# EAGLE schematic Block_Diagram_V1 (EAGLE 8.2.2)
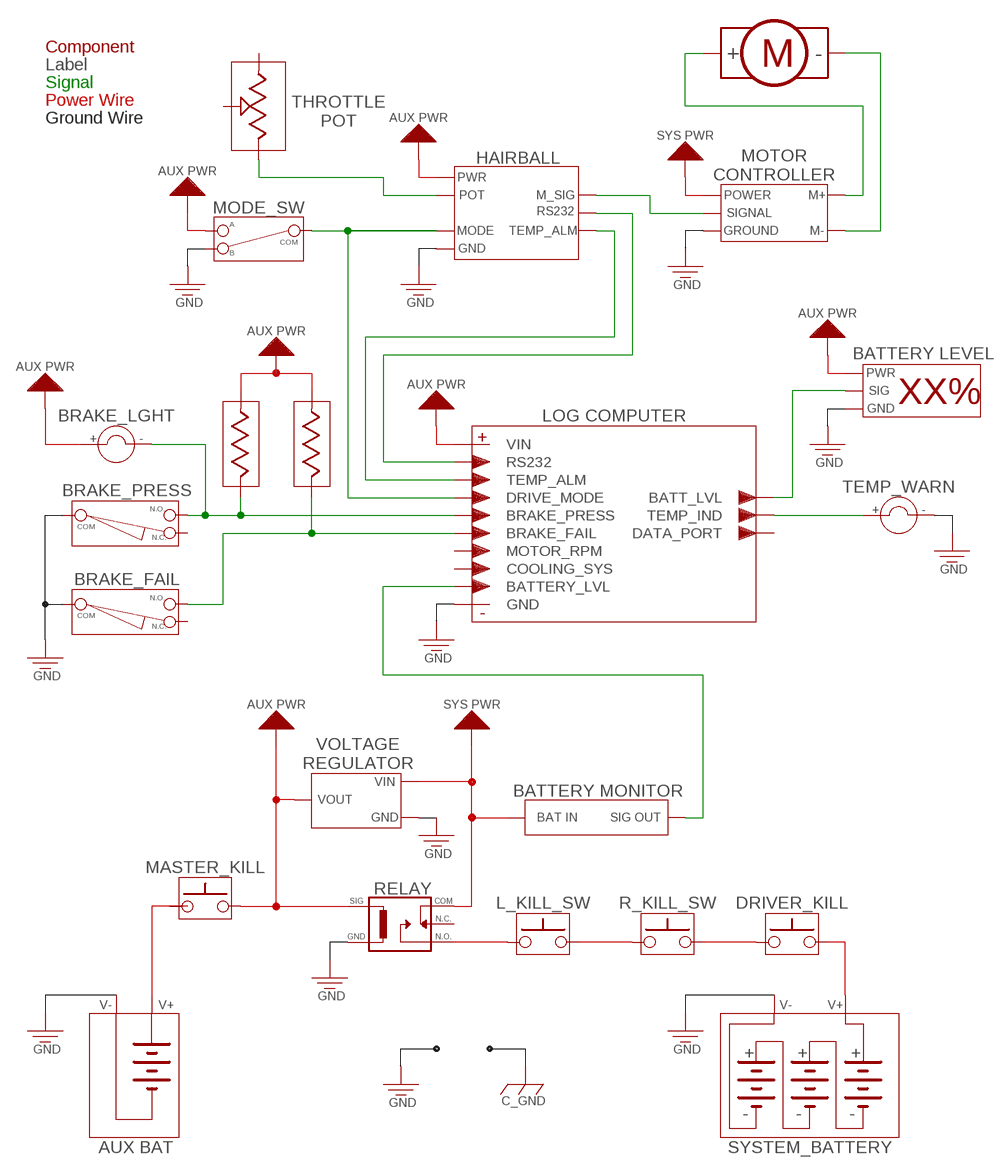
[diagram p0: schematic, sheet 1]

## Parts
BRAKE_FAIL  LIMIT_SWITCH  [LIMIT_SWITCH]
BRAKE_LGHT  LIGHT  [LIGHT]
BRAKE_PRESS  LIMIT_SWITCH  [LIMIT_SWITCH]
DRIVER_KILL  BUTTON_SWITCH  [BUTTON_SWITCH]
L_KILL_SW  BUTTON_SWITCH  [BUTTON_SWITCH]
MASTER_KILL  BUTTON_SWITCH  [BUTTON_SWITCH]
MODE_SW  TOGGLE_SWITCH  [TOGGLE_SWITCH]
R_KILL_SW  BUTTON_SWITCH  [BUTTON_SWITCH]
TEMP_WARN  LIGHT  [LIGHT]
U$1  COMPUTER  [COMPUTER]
U$2  SYSTEM_BAT  [SYSTEM_BAT]
U$3  DC_MOTOR  [DC_MOTOR]
U$4  MOTOR_CONTROLLER  [MOTOR_CONTROLLER]
U$5  HAIRBALL  [HAIRBALL]
U$6  AUX_PWR  [AUX_PWR]
U$7  12V_BAT  [12V_BAT]
U$8  RELAY  [RELAY]
U$9  CHASSIS_GND  [CHASSIS_GND]
U$10  GND  [GND]
U$11  GND  [GND]
U$12  GND  [GND]
U$13  GND  [GND]
U$15  V_SYS  [V_SYS]
U$16  VOLTAGE_REGULATOR  [VOLTAGE_REGULATOR]
U$17  GND  [GND]
U$20  AUX_PWR  [AUX_PWR]
U$21  GND  [GND]
U$22  AUX_PWR  [AUX_PWR]
U$23  GND  [GND]
U$24  V_SYS  [V_SYS]
U$25  GND  [GND]
U$26  BATTERY_MONITOR  [BATTERY_MONITOR]
U$28  THROTTLE_POT  [THROTTLE_POT]
U$29  AUX_PWR  [AUX_PWR]
U$30  GND  [GND]
U$31  AUX_PWR  [AUX_PWR]
U$32  RESISTOR  [RESISTOR]
U$33  RESISTOR  [RESISTOR]
U$35  GND  [GND]
U$36  BATTERY_DISPLAY  [BATTERY_DISPLAY]
U$37  AUX_PWR  [AUX_PWR]
U$38  GND  [GND]
U$40  GND  [GND]
U$41  AUX_PWR  [AUX_PWR]

## Nets
N$1: U$4.SIG U$5.M_SIG(MOTOR_SIG)
N$2: U$3.+ U$4.M+
N$3: U$3.- U$4.M-
N$4: U$1.BATTERY_LVL U$26.SIG
N$5: U$1.RS232 U$5.RS232
N$6: U$1.TEMP_ALM U$5.OVERTEMP
N$7: MODE_SW.COM U$1.DRIVE_MODE U$5.MODE
N$8: U$5.THROTTLE_POT U$28.V-
N$9: BRAKE_LGHT.GND BRAKE_PRESS.NO U$1.BRAKE_PRESS U$32.B
N$10: BRAKE_FAIL.NO U$1.BRAKE_FAIL U$33.B
N$11: U$1.BATT_LVL U$36.SIG
N$12: TEMP_WARN.VIN U$1.TEMP_IND
Unconnected: BRAKE_FAIL.COM BRAKE_FAIL.NC BRAKE_LGHT.VIN BRAKE_PRESS.COM BRAKE_PRESS.NC DRIVER_KILL.A DRIVER_KILL.B L_KILL_SW.A L_KILL_SW.B MASTER_KILL.A MASTER_KILL.B MODE_SW.POS_A MODE_SW.POS_B R_KILL_SW.A R_KILL_SW.B TEMP_WARN.GND U$1.COOLING_SYS U$1.DATAPORT(DATA_PORT) U$1.GND U$1.MOTOR_RPM U$1.PWR(VIN) U$2.V+ U$2.V- U$4.GND U$4.PWR U$5.GND U$5.PWR U$6.AUX_PWR U$7.+12V U$7.GND U$8.COM U$8.GND U$8.NC U$8.NO U$8.SIG U$9.C_GND U$10.GND U$11.GND U$12.GND U$13.GND U$15.V_SYS U$16.GND U$16.VIN U$16.VOUT U$17.GND U$20.AUX_PWR U$21.GND U$22.AUX_PWR U$23.GND U$24.V_SYS U$25.GND U$26.BAT U$28.ADJ U$28.V+ U$29.AUX_PWR U$30.GND U$31.AUX_PWR U$32.A U$33.A U$35.GND U$36.GND U$36.PWR U$37.AUX_PWR U$38.GND U$40.GND U$41.AUX_PWR

## Notes on the sheet
- Component
- Label
- Signal
- Power Wire
- Ground Wire

## Library data of the parts
BRAKE_FAIL BRAKE_PRESS = Custom Block Diagram Parts:LIMIT_SWITCH
BRAKE_LGHT TEMP_WARN = Custom Block Diagram Parts:LIGHT
DRIVER_KILL L_KILL_SW MASTER_KILL R_KILL_SW = Custom Block Diagram Parts:BUTTON_SWITCH
MODE_SW = Custom Block Diagram Parts:TOGGLE_SWITCH
U$1 = Custom Block Diagram Parts:COMPUTER
U$2 = Custom Block Diagram Parts:SYSTEM_BAT
U$3 = Custom Block Diagram Parts:DC_MOTOR
U$4 = Custom Block Diagram Parts:MOTOR_CONTROLLER
U$5 = Custom Block Diagram Parts:HAIRBALL
U$6 U$20 U$22 U$29 U$31 U$37 U$41 = Custom Block Diagram Parts:AUX_PWR
U$7 = Custom Block Diagram Parts:12V_BAT
U$8 = Custom Block Diagram Parts:RELAY
U$9 = Custom Block Diagram Parts:CHASSIS_GND
U$10-U$13 U$17 U$21 U$23 U$25 U$30 U$35 U$38 U$40 = Custom Block Diagram Parts:GND
U$15 U$24 = Custom Block Diagram Parts:V_SYS
U$16 = Custom Block Diagram Parts:VOLTAGE_REGULATOR
U$26 = Custom Block Diagram Parts:BATTERY_MONITOR
U$28 = Custom Block Diagram Parts:THROTTLE_POT
U$32 U$33 = Custom Block Diagram Parts:RESISTOR
U$36 = Custom Block Diagram Parts:BATTERY_DISPLAY